# EAGLE design rj45UsbBreakout (EAGLE 6.4)
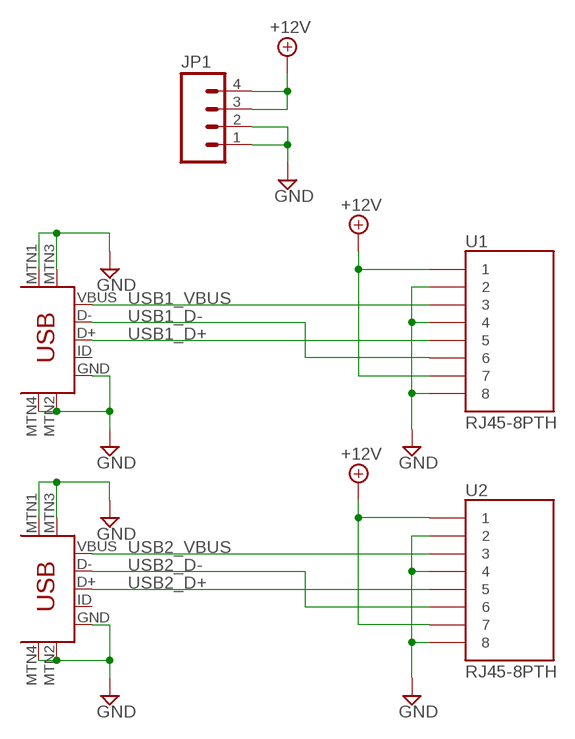
[diagram p0: schematic, sheet 1]

## Parts
JP1  M04LOCK  [1X04_LOCK]
U1  RJ45-8PTH  [RJ45-8]
U2  RJ45-8PTH  [RJ45-8]
U3  USB-MINIB-5PIN  [USB-MINIB]
U4  USB-MINIB-5PIN  [USB-MINIB]

## Nets
+12V: JP1.3 JP1.4 U1.1 U1.7 U2.1 U2.7
GND: JP1.1 JP1.2 U1.2 U1.4 U1.8 U2.2 U2.4 U2.8 U3.GND U3.MTN1(MTN2) U3.MTN2(MTN3) U3.MTN3(MTN1) U3.MTN4 U4.GND U4.MTN1(MTN2) U4.MTN2(MTN3) U4.MTN3(MTN1) U4.MTN4
USB1_D+: U1.5 U3.D+
USB1_D-: U1.6 U3.D-
USB1_VBUS: U1.3 U3.VBUS
USB2_D+: U2.5 U4.D+
USB2_D-: U2.6 U4.D-
USB2_VBUS: U2.3 U4.VBUS
Unconnected: U3.ID U4.ID

## Library data of the parts
JP1 = SparkFun-Connectors:M04: Header 4 Standard 4-pin 0.1" header. Use with straight break away headers (SKU : PRT-00116), right angle break away headers (PRT-00553), swiss pins (PRT-00743), machine pins (PRT-00117), and female headers (PRT-00115). Molex polarized connector foot print use with SKU : PRT-08231 with associated crimp pins and housings. 1MM SMD Version SKU: PRT-10208
U1 U2 = SparkFun-Connectors:RJ45-8: RJ45 Jack Simple RJ45, 8-pin connection - connector for common Cat5, Cat5e, and Cat6 Ethernet cables. Footprint not yet proven in production. Connector sku is PRT-00643; Breakout PCB sku is BOB-00716.
U3 U4 = SparkFun-Connectors:USB-MINIB: Mini-USB "B" connector with 5th pin broken out. Created new symbol breaking out 5th "ID" pin in mini/micro USB connector spec. See: http://en.wikipedia.org/wiki/Mini_usb#Cables. Uses same footprint as 4-pin symbol. Also added pins to connect to mounting / shield pads if required (probably not generally needed as signals aren't shielded once they leave the connector).

## Board
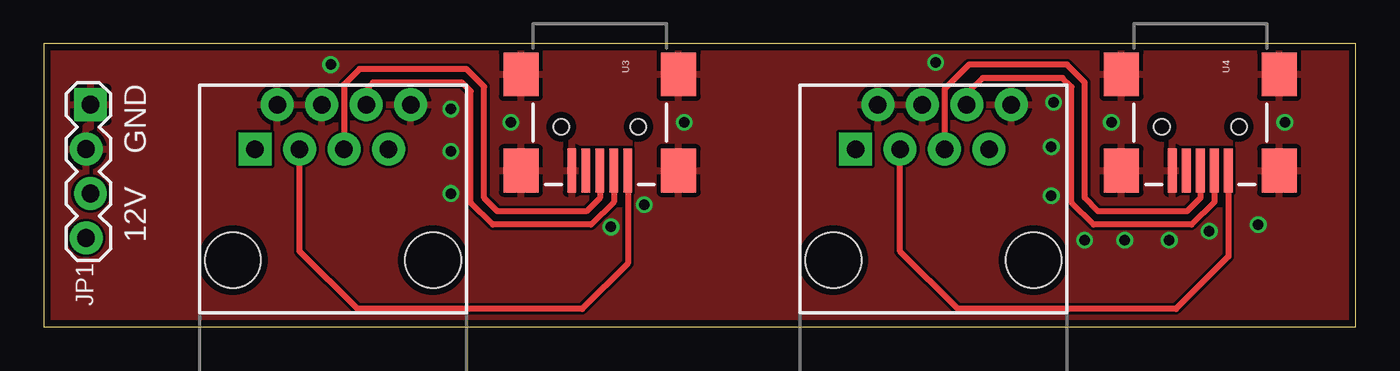
[diagram p1: board, top side]
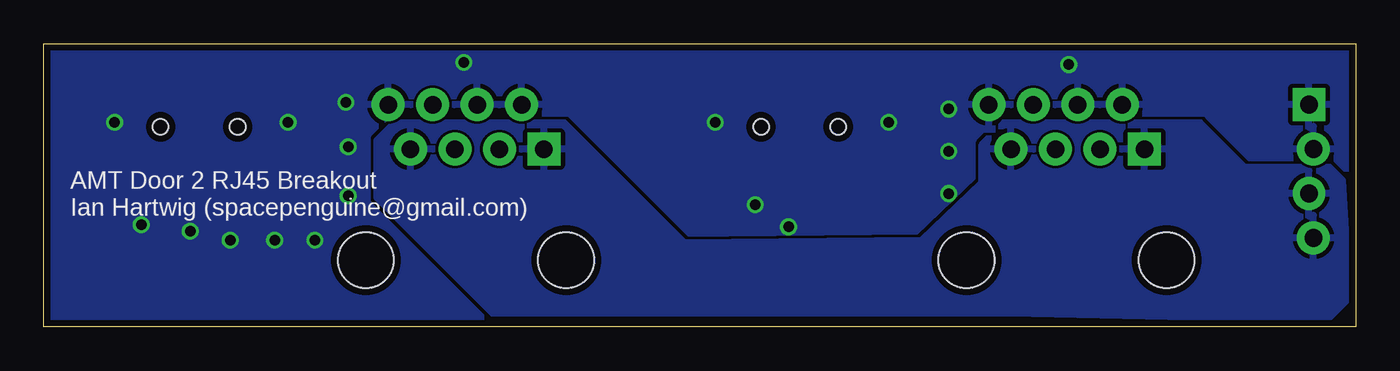
[diagram p2: board, bottom side, seen from below]

Size 74.91 x 16.18 mm. Coordinates in mm from the lower left corner, seen from the top.
Outline: 0,0 74.91,0 74.91,16.18 0,16.18 0,0
Copper layers (1*16): Top 0.0356mm / dielectric 1.5011mm / Bottom 0.0356mm
Design rules "LaenPCBOrder": minimum track width 6mil, minimum drill 13mil, track to track 6mil, track to pad 6mil, pad to pad 6mil, via to via 6mil, smd to smd 6mil, copper to edge 15mil, drill to drill 6mil, minimum pad ring 7mil, minimum via ring 7mil, stop-mask expansion 3mil, vias tented up to drill 0mil, thermal gap 10mil

### Footprints (pad centres in the part's own frame; a part is rotated, then mirrored left to right if it is on the bottom)
1X04_LOCK = drill 1.016 pad 1.88 square: 1 0,0.127 | drill 1.016 pad 1.88: 2 2.54,-0.127; 3 5.08,0.127; 4 7.62,-0.127
RJ45-8 = drill 1 pad 1.88 square: 1 -4.445,6.35 | drill 1 pad 1.88: 2 -3.175,8.89; 3 -1.905,6.35; 4 -0.635,8.89; 5 0.635,6.35; 6 1.905,8.89; 7 3.175,6.35; 8 4.445,8.89 | hole 3.2: -5.715,0; 5.715,0
USB-MINIB = smd 2.5 x 0.5: D+ 2.5,0; D- 2.5,0.8; GND 2.5,-1.6; ID 2.5,-0.8; VBUS 2.5,1.6 | smd 2.5 x 2: MTN1 -3,4.5; MTN2 2.5,4.5; MTN3 -3,-4.5; MTN4 2.5,-4.5 | hole 0.9: 0,2.2; 0,-2.2

### Placement (x,y rotation side)
JP1  2.54,12.7 270 top
U1  16.51,3.81 0 top
U2  50.8,3.81 0 top
U3  31.75,11.43 270 top
U4  66.04,11.43 270 top

### Tracks (layer width: path | path; a pad name or v marks a point on that pad's centre or on a via)
+12V
  pour Bottom: 1.52,9.14 0.76,8.38 0.38,1.65 1.65,0.38 19.81,0.76 49.28,0.76 55.88,7.37 55.88,10.67 54.86,11.68 45.21,11.68 38.35,4.83 24.77,4.95 21.34,8.26 21.34,10.41 20.07,11.68 8.89,11.68 6.35,9.14
GND  (via drill 0.6)
  other vias: 23.24,12.45 26.67,11.68 36.58,11.68 34.29,6.99 57.66,12.83 60.96,11.68 70.87,11.68 69.34,5.84 23.24,7.62 32.38,5.71 16.38,14.99 50.93,15.11 57.53,7.49 66.55,5.46 64.26,4.95 61.72,4.95 59.44,4.95 57.53,10.29 23.24,10.03
  pour Top (rank 6): 0,0 0,16.26 74.93,16.26 74.93,0 2.54,0
  pour Bottom (rank 6): 0,0 0,16.26 74.93,16.26 74.93,0 72.39,0
USB1_D+
  Top 0.356: U3.D+ 31.75,7.37 30.99,6.6 25.91,6.6 25.15,7.37 25.15,13.72 24.13,14.73 18.03,14.73 17.14,13.84 U1.5
USB1_D-
  Top 0.356: U3.D- 32.55,7.15 31.24,5.84 25.65,5.84 24.38,7.11 24.38,13.46 23.88,13.97 18.8,13.97 18.54,13.72 18.54,12.83 U1.6
USB1_VBUS
  Top 0.356: U3.VBUS 33.35,3.63 30.73,1.02 17.91,1.02 14.61,4.32 U1.3
USB2_D+
  Top 0.356: U4.D+ 66.04,7.37 65.28,6.6 60.2,6.6 59.44,7.37 59.44,13.97 58.42,14.99 52.83,14.99 51.44,13.59 U2.5
USB2_D-
  Top 0.356: U4.D- 66.84,7.15 65.53,5.84 59.94,5.84 58.67,7.11 58.67,13.72 58.17,14.22 53.59,14.22 52.83,13.46 52.83,12.83 U2.6
USB2_VBUS
  Top 0.356: U4.VBUS 67.64,4.01 64.64,1.02 52.2,1.02 48.9,4.32 U2.3

### Text on the board
tNames: GND | 12V
bNames: AMT Door 2 RJ45 Breakout / Ian Hartwig (spacepenguine@gmail.com)